# Altium schematic sheet USBC_PD_Controller.SchDoc
size A; SheetNumber: 1; SheetTotal: 8
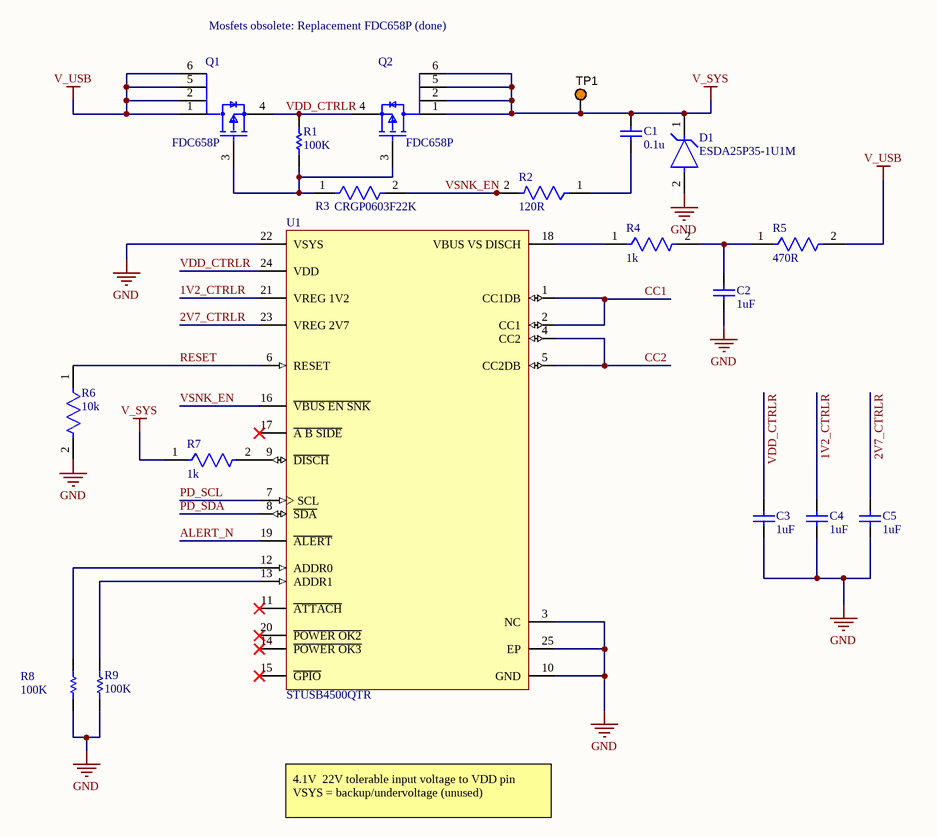
[diagram p0: USBC_PD_Controller.SchDoc]

## Parts
C1  0.1u  [CAPC2013X140X50ML20T25]
C2  1uF  [CAPC2013X145X50NL20T20]
C3  1uF  [CAPC2013X145X50NL20T20]
C4  1uF  [CAPC2013X145X50NL20T20]
C5  1uF  [CAPC2013X145X50NL20T20]
D1  ESDA25P35-1U1M  [FP-QFN_1610-MFG]
Q1  FDC658P  [FP-419BL-MFG]
Q2  FDC658P  [FP-419BL-MFG]
R1  100K  [RESC0603(1608)_N]
R2  120R  [FP-SR0603-MFG]
R3  CRGP0603F22K  [FP-CRGP0603-IPC_C]
R4  1k  [FP-MCT0603-IPC_C]
R5  470R  [FP-CRCW0603-HPe3-MFG]
R6  10k  [FP-CRCW0603-e3-IPC_A]
R7  1k  [FP-MCT0603-IPC_C]
R8  100K  [RESC0603(1608)_N]
R9  100K  [RESC0603(1608)_N]
TP1  5003  [KSTN-5003]  (value not drawn)
U1  STUSB4500QTR  [FP-QFN-24-EP_4x4-MFG]

## Nets
GND: C2.2 C3.2 C4.2 C5.2 D1.2(A) R6.2 R8.1 R9.1 U1.3(NC) U1.10(GND) U1.22(VSYS) U1.25(EP)
V_SYS: C1.1 D1.1(C) Q2.1(D) Q2.2(D) Q2.5(D) Q2.6(D) R7.1 TP1.1
V_USB: Q1.1(D) Q1.2(D) Q1.5(D) Q1.6(D) R5.2
1V2_CTRLR: C4.1 U1.21(VREG_1V2)
2V7_CTRLR: C5.1 U1.23(VREG_2V7)
ALERT_N: U1.19(~{ALERT})
CC1: U1.1(CC1DB) U1.2(CC1)
CC2: U1.4(CC2) U1.5(CC2DB)
PD_SCL: U1.7(SCL)
PD_SDA: U1.8(~{SDA})
RESET: R6.1 U1.6(RESET)
VDD_CTRLR: C3.1 Q1.4(S) Q2.4(S) R1.2 U1.24(VDD)
VSNK_EN: R2.2 R3.2 U1.16(~{VBUS_EN_SNK})
NetC1_2: C1.2 R2.1
NetC2_1: C2.1 R4.2 R5.1
NetQ1_3: Q1.3(G) Q2.3(G) R1.1 R3.1
NetR4_1: R4.1 U1.18(VBUS_VS_DISCH)
NetR7_2: R7.2 U1.9(~{DISCH})
NetR8_2: R8.2 U1.12(ADDR0)
NetR9_2: R9.2 U1.13(ADDR1)

Not connected (* = marked no-connect by the designer): U1 11(~{ATTACH})* 14(~{POWER_OK3})* 15(~{GPIO})* 17(~{A_B_SIDE})* 20(~{POWER_OK2})*

## Notes on the sheet
- Mosfets obsolete: Replacement FDC658P (done)
- 4.1V  22V tolerable input voltage to VDD pin
  VSYS = backup/undervoltage (unused)

## Library data of the parts
C1 = CMP-2007-04651-1: Part Number: 0805DD104KAT2A; Manufacturer: AVX Interconnect / Elco
C2-C5 = CMP-2007-01676-1: Part Number: VJ0805Y105KXQRW1BC; Manufacturer: Vitramon
D1 = CMP-12225-000030-1: TVS DIODE 22V 41V 1610; Manufacturer: STMicroelectronics; Clamping Voltage: 39V; Breakdown Voltage: 23.3V; Max Junction Temp: +150°C; Peak Pulse Current: 35A; Number Of Channels: 1; Peak Pulse Power: 1400W; Standoff Height: 0.02mm; Direction: Unidirectional; ComponentLink2URL: https://www.st.com/resource/en/datasheet/esda25p35-1u1m.pdf; Height: 0.6mm; Device Class L2: TVS Diodes; Temperature: -55°C to +150°C; Category: Diode; Temperature Range Low: -55°C; Digikey Description: TVS DIODE 22V 41V 1610; Reverse Standoff Voltage: 22V; Lead Free: Yes; Automotive: No; RoHS: TRUE; Manufacturer Part Number: ESDA25P35-1U1M; Temperature Range High: +150°C; Package: QFN_1610; Device Class L1: Circuit Protection; Device Class L3: unset; ComponentLink2Description: Datasheet; Octopart: https://octopart.com/esda25p35-1u1m-stmicroelectronics-75302699; Mouser Description: ESDA Series 1400 W 25 V Uni-Directional Surface Mount TVS Diode - QFN-1610
Q1 Q2 = CMP-07173-000014-1: MOSFET P-CH 30V 4A SSOT-6; Manufacturer: ON Semiconductor; Pulse Drain Current: -20A; Drain To Source Breakdown Voltage: -30V; Continuous Drain Current: -4A; Turn On Delay Time: 12ns; Input Capacitace At Vds: 750pF @ -15V; Max Forward Diode Voltage: -1.2V; Depletion Mode: False; Number Of Channels: 1; Standoff Height: 0mm; Typ Forward Diode Voltage: -0.76V; Drain To Source Resistance: 0.041Ω; Power Dissipation: 0.8W; Rthja Max: 78°C/W; Turn Off Delay Time: 24ns; Threshold Vgs Max: -3V; Transconductance: 9S; Max Junction Temp: +150°C; Threshold Vgs Min: -1V; Gate To Source Voltage: 20V; Gate Charge At Vgs: 8nC @ -5V; Temperature Range Low: -55°C; Temperature: -55°C to +150°C; Octopart: https://octopart.com/fdc658p-on+semiconductor-84325768; Lead Free: Yes; Drain To Source Voltage: -30V; Device Class L1: Discrete Semiconductors; Manufacturer Part Number: FDC658P; Package: 419BL; ComponentLink2URL: https://www.onsemi.com/pub/Collateral/FDC658P-D.PDF; Height: 1.1mm; Mouser Description: MOSFET SSOT-6 P-CH -30V; Digikey Description: MOSFET P-CH 30V 4A SSOT-6; RoHS: TRUE; Temperature Range High: +150°C; Device Class L2: Transistors; Automotive: No; Device Class L3: MOSFETs; Footprint Url: https://www.onsemi.com/pub/Collateral/419BL.PDF; Number Of P Channels: 1; ComponentLink2Description: Datasheet; Category: Trans
R1 R8 R9 = CMP-1012-00736-1: 100K 0.1W 1% 0603 (1608 Metric)  SMD; Value: 100000.00 Ohm; Case-Metric: 1608; Case-EIA: 0603; Power: 0.1 W; Tolerance: 1 %; Technology: SMT
R2 = CMP-03412-000681-1: RES SMD 0603 1/4W 1% 120 OHM; Manufacturer: Yageo; Manufacturer Part Number: SR0603FR-7T120RL; Automotive Grade: Grade 0; Voltage Rating: 75V; Value: 120Ω; Power Rating: 0.25W; Tolerance: 0.01; Octopart: https://octopart.com/sr0603fr-7t120rl-yageo-92673849; Lead Free: Yes; Ipc Land Pattern Name: RESC16080X45; ComponentLink2URL: http://www.yageo.com/documents/recent/PYu-SR_D_F%20tol_RoHS_L_3.pdf; RoHS: TRUE; Category: Res; Digikey Description: RES SMD 0603 1/4W 1% 120 OHM; Footprint Url: http://www.yageo.com/exep/pages/download/literatures/PYu-R_Mount_10.pdf; ComponentLink2Description: Datasheet; Temperature Range High: +155°C; Device Class L3: Chip SMD Resistors; Mouser Description: Surge Chip Resistor Automotive Grade Thick Film 0603 120Ohm 1% Paper T/R; Resistance: 120Ω; Height: 0.55mm; Temperature Range Low: -55°C; Automotive: Yes; Temperature: -55°C to +155°C; Device Class L1: Passive Components; Package: SR0603; Series: SR; Device Class L2: Resistors; Composition: Thick Film
R3 = CMP-03211-006681-1: CRGP 0603 22K 1%; Manufacturer: TE; Resistance: 22KΩ; Power Rating: 0.25W; Temperature Coefficient: ±100ppm/°C; Tolerance: 0.01; Voltage Rating: 50V; Value: 22KΩ; Lead Free: Yes; Device Class L3: Chip SMD Resistors; Ipc Land Pattern Name: RESC16080X45; Composition: Thick Film; Octopart: https://octopart.com/crgp0603f22k-te+connectivity-91018742; RoHS: TRUE; ComponentLink2Description: Datasheet; Digikey Description: CRGP 0603 22K 1%; Category: Res; Temperature: -55°C to +155°C; Manufacturer Part Number: CRGP0603F22K; Temperature Range High: +155°C; Series: CRGP; ComponentLink2URL: https://www.te.com/commerce/DocumentDelivery/DDEController?Action=srchrtrv&DocNm=9-1773463-9&DocType=DS&DocLang=English; Device Class L2: Resistors; Height: 0.55mm; Ambient Temperature Range High: +70°C; Device Class L1: Passive Components; Automotive: No; Temperature Range Low: -55°C; Package: CRGP0603
R4 R7 = CMP-02407-000843-1: RES SMD 100 OHM 1% 1/8W 0603; Resistance: 1kR; Max Power Dissipation: 125mW; Tolerance: 0.1%; Temperature Coefficient: 25ppm/°C; Height: 0.022inch; Packaging: Tape and Reel; Composition: Thin Film; Number of Terminations: 2; Length: 0.061inch; Width: 0.033inch; Case/Package: 0603
R5 = CMP-02407-009460-1: RES Thick Film, 470Ω, 5%, 0.33W, 200ppm/°C, 0603; Max Power Dissipation: 250mW; Voltage Rating: 75V; Case/Package: 0603; Lead Free: Lead Free; Min Operating Temperature: -55°C; Features: Automotive AEC-Q200; Temperature Coefficient: 200ppm/°C; Max Operating Temperature: 155°C; Number of Terminations: 2; Width: 0.8mm; Weight: 7.1E-05oz; Case Code (Imperial): 0603; Radiation Hardening: No; Tolerance: 5%; Termination: SMD/SMT; Contact Plating: Tin; Case Code (Metric): 1608; Packaging: Tape and Reel; Package Quantity: 5000; Resistance: 470R; Length: 0.063inch; Composition: Thick Film; Power Rating: 250mW; Height: 0.022inch
R6 = CMP-02407-003273-1: RES Thick Film, 10kΩ, 1%, 0.1W, 100ppm/°C, 0603; Max Power Dissipation: 100mW; Resistance: 10kR; Tolerance: 1%; Packaging: Tape and Reel; Lead Free: Lead Free; Max Operating Temperature: 155°C; Min Operating Temperature: -55°C; Package Quantity: 10000; Length: 0.061inch; Height: 0.02inch; Width: 0.033inch; Composition: Thick Film; Number of Terminations: 2; Case/Package: 0603; Features: Automotive AEC-Q200; Temperature Coefficient: 100ppm/°C
TP1 = CMP-1672-00009-1: Test Point, Orange, 1-Pin THD, RoHS; Peak Reverse Current: 600 uA; Forward Current: 3 A; Max Surge Current: 80 A; Forward Voltage: 1.08 V; Max Operating Temperature: 150 degC; PackageReference: 5003; Pins: 2; ComponentLink2URL: http://keyelco.com/userAssets/file/M65p56.pdf; PackageDescription: 1-Pin Through Hole Device, Dia 2.54 mm; Weight: 0.01 lb; Diameter: 5.3 mm; Mount: Through Hole; Package Quantity: 500; Packaging: Bulk; Min Operating Temperature: -65 degC; ComponentLink1Description: Manufacturer URL; Height: 0.25 inch; ComponentLink1URL: http://www.keyelco.com/; ComponentLink2Description: Datasheet; Width: 0.25 inch; REACH SVHC: No SVHC; RoHSCompliant: true; Radiation Hardening: No; Length: 9.5 mm; DatasheetVersion: Jun-15
U1 = CMP-12113-000003-3: 4.1V~22V USB 2.0 I2C Controllers Interface ICs STUSB45 Controller 24-VFQFN Exposed Pad; Number of Ports: 1; Min Supply Voltage: 3V; Max Junction Temperature (Tj): 145°C; Max Supply Voltage: 22V; Interface: I2C, USB; USB Standard: USB 2.0; Lifecycle Status: Production; Schedule B: 8542390000, 8542390000; Min Operating Temperature: -40°C; Ambient Temperature Range High: 105°C; Max Operating Temperature: 105°C; Height: 1mm